# Altium schematic sheet RS422.SchDoc
size A3; SheetNumber: 21; SheetTotal: 23
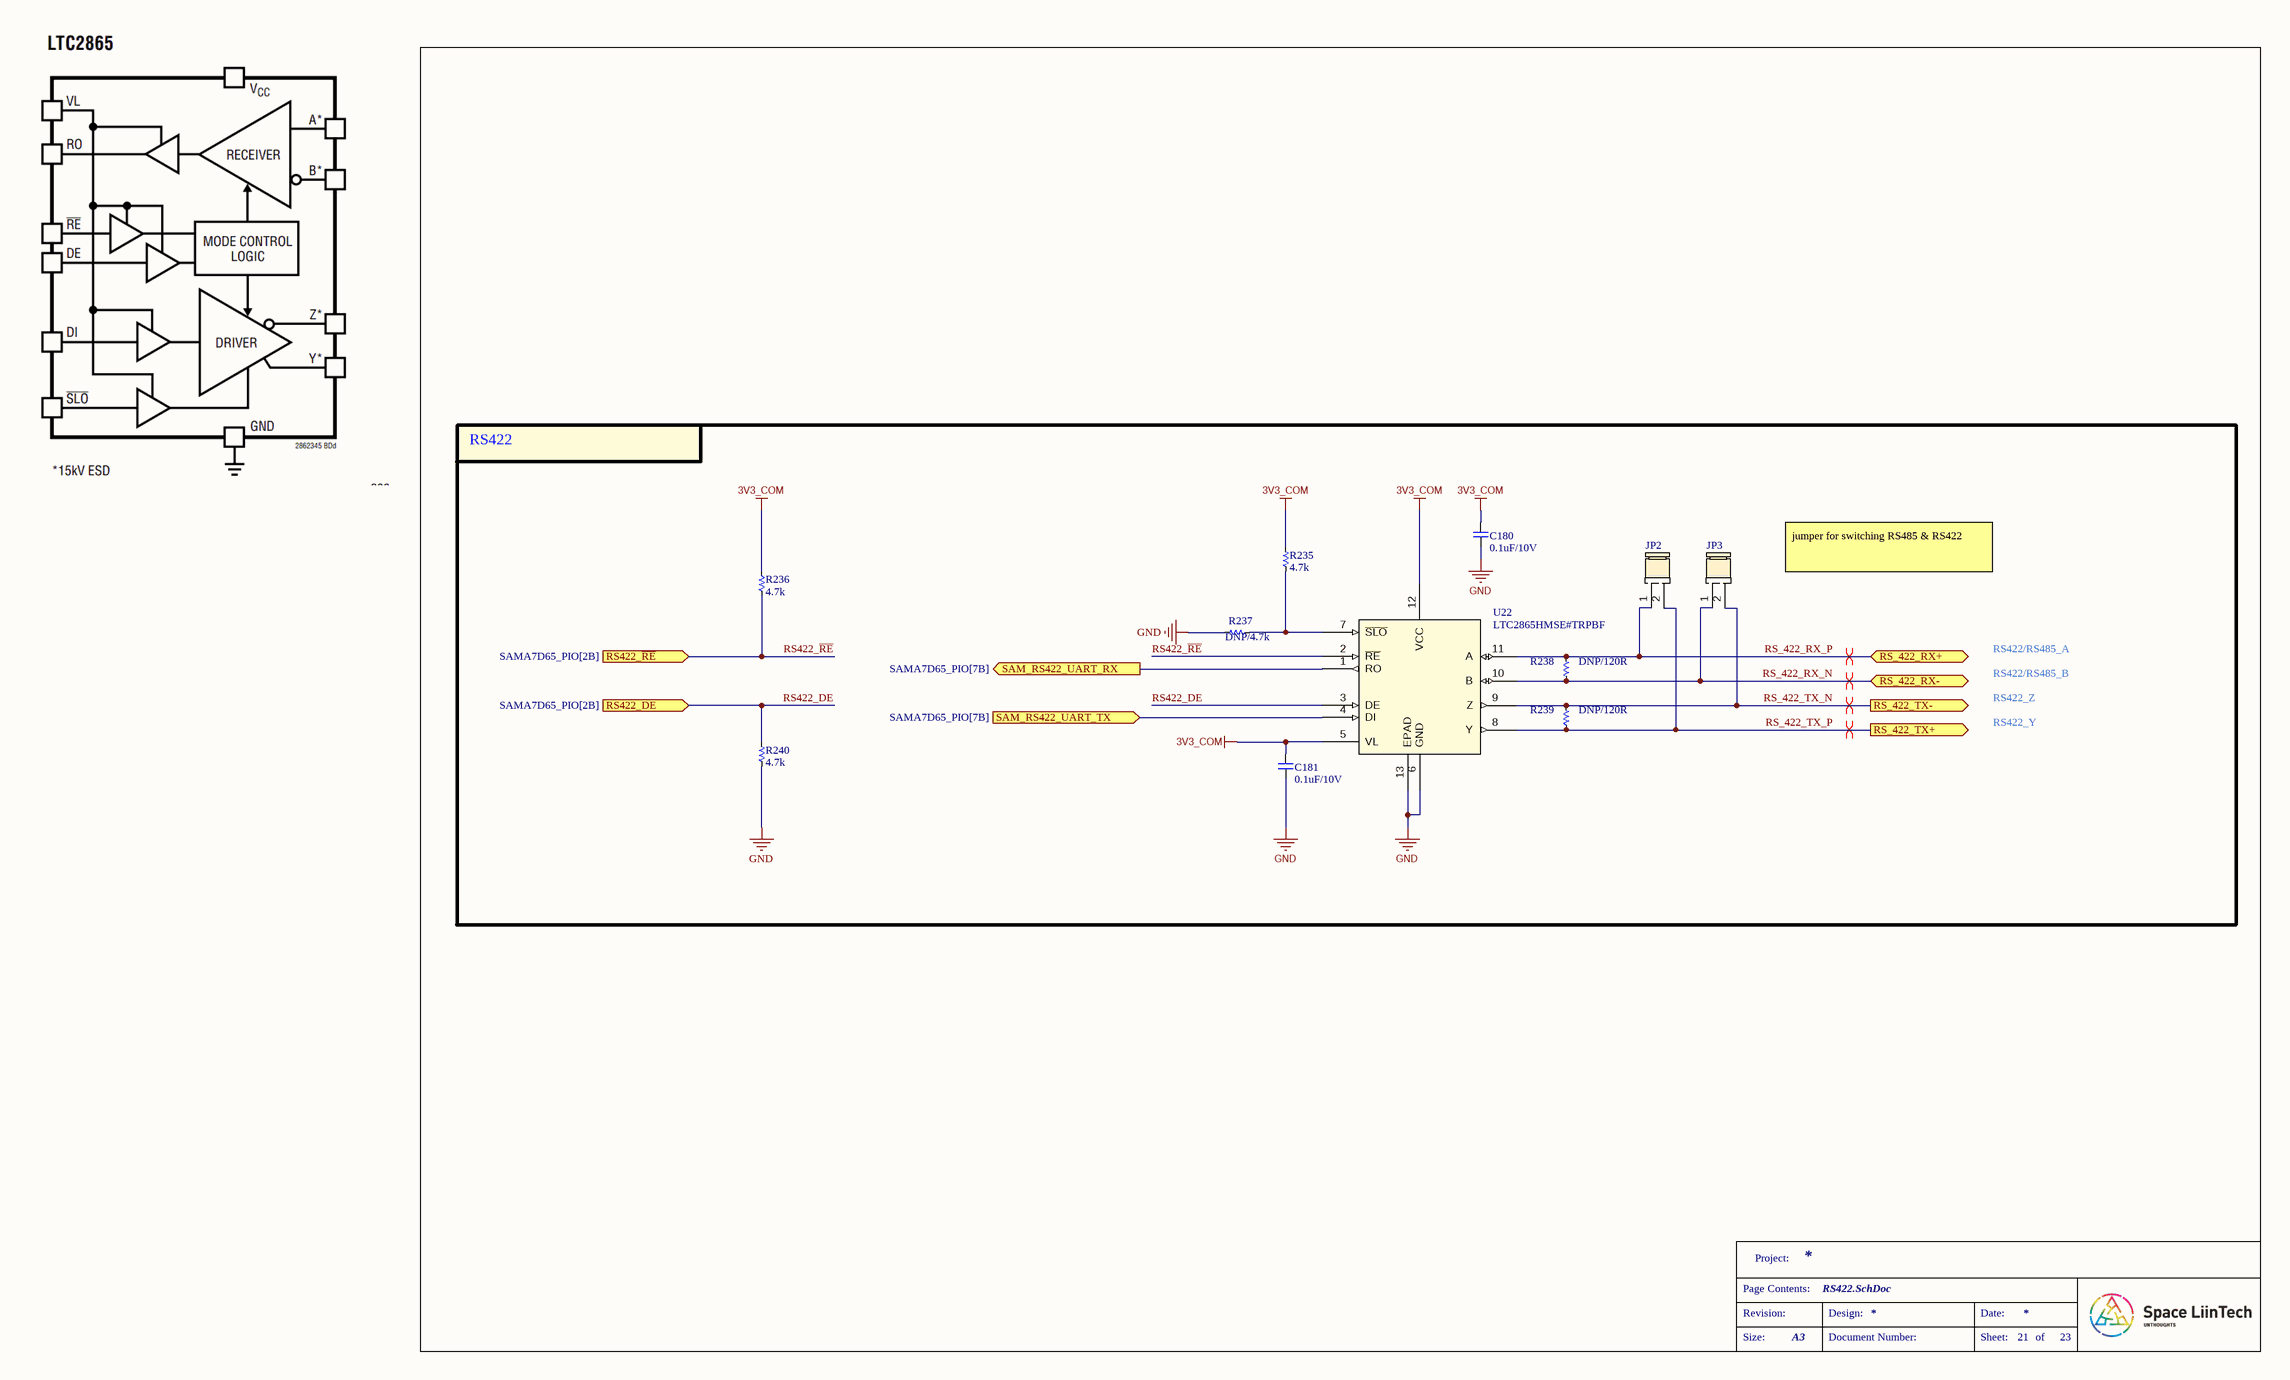
[diagram p0: RS422.SchDoc]

## Parts
C180  0.1uF/10V  [CAP_C_1005X50_L]
C181  0.1uF/10V  [CAP_C_1005X50_L]
JP2  JUMPER_254P_NOPLACE  [JUMPER_254P_2X1_NOPLACE]  (value not drawn)
JP3  JUMPER_254P_NOPLACE  [JUMPER_254P_2X1_NOPLACE]  (value not drawn)
R235  4.7k  [RES_C_1005x30_L]
R236  4.7k  [RES_C_1005x30_L]
R237  DNP/4.7k  [RES_C_1005X40]
R238  DNP/120R  [RES_C_1005x30_L]
R239  DNP/120R  [RES_C_1005x30_L]
R240  4.7k  [RES_C_1005x30_L]
U22  LTC2865HMSE#TRPBF  [MSOP-12_MSE_LIT]

## Ports
RS422_DE (in, see SAMA7D65_PIO[2B]), RS422_~{RE} (in, see SAMA7D65_PIO[2B]), RS_422_RX+ (bidir, see CONNECTOR_INTERFACE[2A]), RS_422_RX- (bidir, see CONNECTOR_INTERFACE[2A]), RS_422_TX+ (out, see CONNECTOR_INTERFACE[2A]), RS_422_TX- (out, see CONNECTOR_INTERFACE[2A]), SAM_RS422_UART_RX (out, see SAMA7D65_PIO[7B]), SAM_RS422_UART_TX (in, see SAMA7D65_PIO[7B])

## Nets
3V3_COM: C180.2 C181.2 R235.2 R236.2 U22.5(VL) U22.12(VCC)
GND: C180.1 C181.1 R237.2 R240.1 U22.6(GND) U22.13(EPAD)
RS422_DE: R240.2 U22.3(DE) ; port RS422_DE
RS422_~{RE}: R236.1 U22.2(~{RE}) ; port RS422_~{RE}
RS_422_RX_N: JP3.1 R238.2 U22.10(B) ; port RS_422_RX-
RS_422_RX_P: JP2.1 R238.1 U22.11(A) ; port RS_422_RX+
RS_422_TX_N: JP3.2 R239.1 U22.9(Z) ; port RS_422_TX-
RS_422_TX_P: JP2.2 R239.2 U22.8(Y) ; port RS_422_TX+
SAM_RS422_UART_RX: U22.1(RO) ; port SAM_RS422_UART_RX
SAM_RS422_UART_TX: U22.4(DI) ; port SAM_RS422_UART_TX
NetR235_1: R235.1 R237.1 U22.7(~{SLO})

## Layout directives
differential pair: RS_422_RX_N, RS_422_RX_P, RS_422_TX_N, RS_422_TX_P

## Notes on the sheet
- RS422
- jumper for switching RS485 & RS422
- RS422/RS485_A
- RS422/RS485_B
- RS422_Z
- RS422_Y
- Project:
- Page Contents:
- Revision:
- Design:
- Date:
- Size:
- A3
- Document Number:
- Sheet:
- of

## Library data of the parts
C180 C181 = _CAP_C_2: CAP CHIP
R235-R240 = _RES_B_2: RES
U22 = LTC2865HMSETRPBF: Â±60V Fault Protected 3V to 5.5V RS485/RS422 Transceivers; Manufacturer_Name: Analog Devices Inc; Copyright: Copyright (C) 2025 Ultra Librarian. All rights reserved.; Manufacturer_Part_Number: LTC2865HMSE#TRPBF; RefDes: RefDes; Type: Type